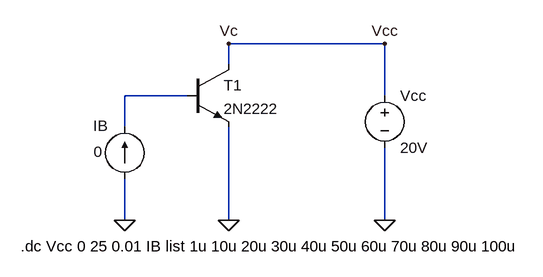
[diagram p0: schematic Draft1.asc]
Draft1.asc, the LTspice schematic file:
Version 4
SHEET 1 880 680
WIRE 384 48 144 48
WIRE 144 80 144 48
WIRE 80 128 -16 128
WIRE 384 128 384 48
WIRE -16 176 -16 128
WIRE -16 320 -16 256
WIRE 144 320 144 176
WIRE 384 320 384 208
FLAG 144 320 0
FLAG 384 320 0
FLAG -16 320 0
FLAG 144 48 Vc
FLAG 384 48 Vcc
SYMBOL npn 80 80 R0
SYMATTR InstName T1
SYMATTR Value 2N2222
SYMBOL current -16 256 R180
WINDOW 0 26 82 Left 2
WINDOW 3 34 42 Left 2
WINDOW 123 0 0 Left 0
WINDOW 39 0 0 Left 0
SYMATTR InstName IB
SYMATTR Value 0
SYMBOL voltage 384 112 R0
WINDOW 123 0 0 Left 0
WINDOW 39 0 0 Left 0
SYMATTR InstName Vcc
SYMATTR Value 20V
TEXT -176 360 Left 2 !.dc Vcc 0 25 0.01 IB list 1u 10u 20u 30u 40u 50u 60u 70u 80u 90u 100u

The netlist it stands for:
* Draft1.asc
Q§T1 Vcc N001 0 0 2N2222
IB 0 N001 0
Vcc Vcc 0 20V
.model NPN NPN
.model PNP PNP
.lib standard.bjt
.dc Vcc 0 25 0.01 IB list 1u 10u 20u 30u 40u 50u 60u 70u 80u 90u 100u
.backanno
.end